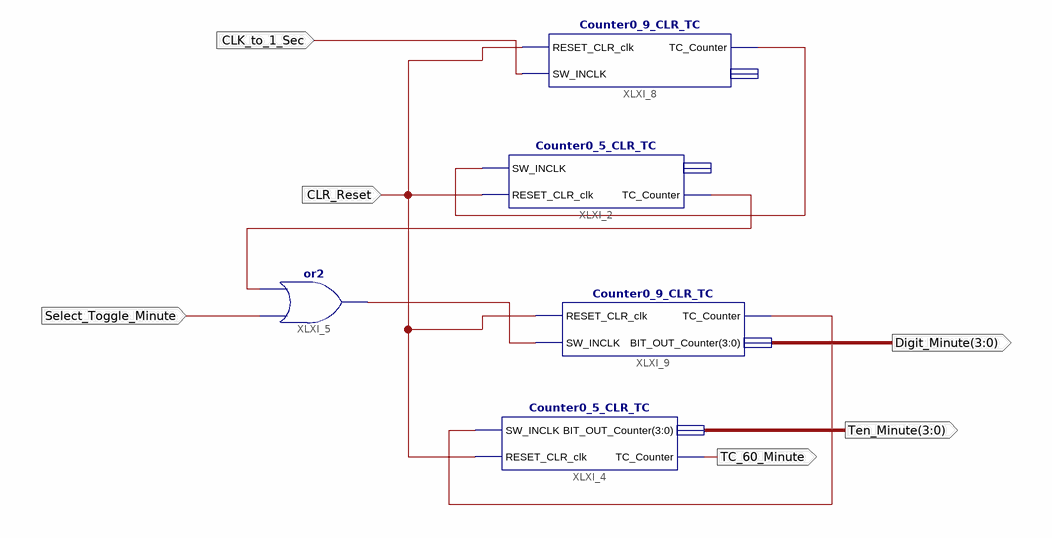
[diagram p0: schematic sheet 1]
// Xilinx ISE schematic Time_60_Second_And_Minute.sch (spartan6) as structural Verilog: 5 symbols, 6 ports
module Time_60_Second_And_Minute (
  input  CLR_Reset,
  input  CLK_to_1_Sec,
  input  Select_Toggle_Minute,
  output TC_60_Minute,
  output [3:0] Ten_Minute,
  output [3:0] Digit_Minute
);

  wire XLXN_17, XLXN_18, XLXN_43, XLXN_46;

  Counter0_5_CLR_TC XLXI_2 (
    .SW_INCLK(XLXN_43), .RESET_CLR_clk(CLR_Reset), .TC_Counter(XLXN_18));  // open: BIT_OUT_Counter
  Counter0_5_CLR_TC XLXI_4 (
    .SW_INCLK(XLXN_46), .RESET_CLR_clk(CLR_Reset), .BIT_OUT_Counter(Ten_Minute), .TC_Counter(TC_60_Minute));
  or XLXI_5 (XLXN_17, Select_Toggle_Minute, XLXN_18);
  Counter0_9_CLR_TC XLXI_8 (
    .RESET_CLR_clk(CLR_Reset), .SW_INCLK(CLK_to_1_Sec), .TC_Counter(XLXN_43));  // open: BIT_OUT_Counter
  Counter0_9_CLR_TC XLXI_9 (
    .BIT_OUT_Counter(Digit_Minute), .RESET_CLR_clk(CLR_Reset), .SW_INCLK(XLXN_17), .TC_Counter(XLXN_46));
endmodule
